# Altium schematic sheet S7CAS-PLEIADES-CARTE-FILLE_P02_DAC.SchDoc
size Tabloid; DocumentNumber: 5; SheetNumber: 5; SheetTotal: 5; Size: 11x17; Sheet_Name: DAC
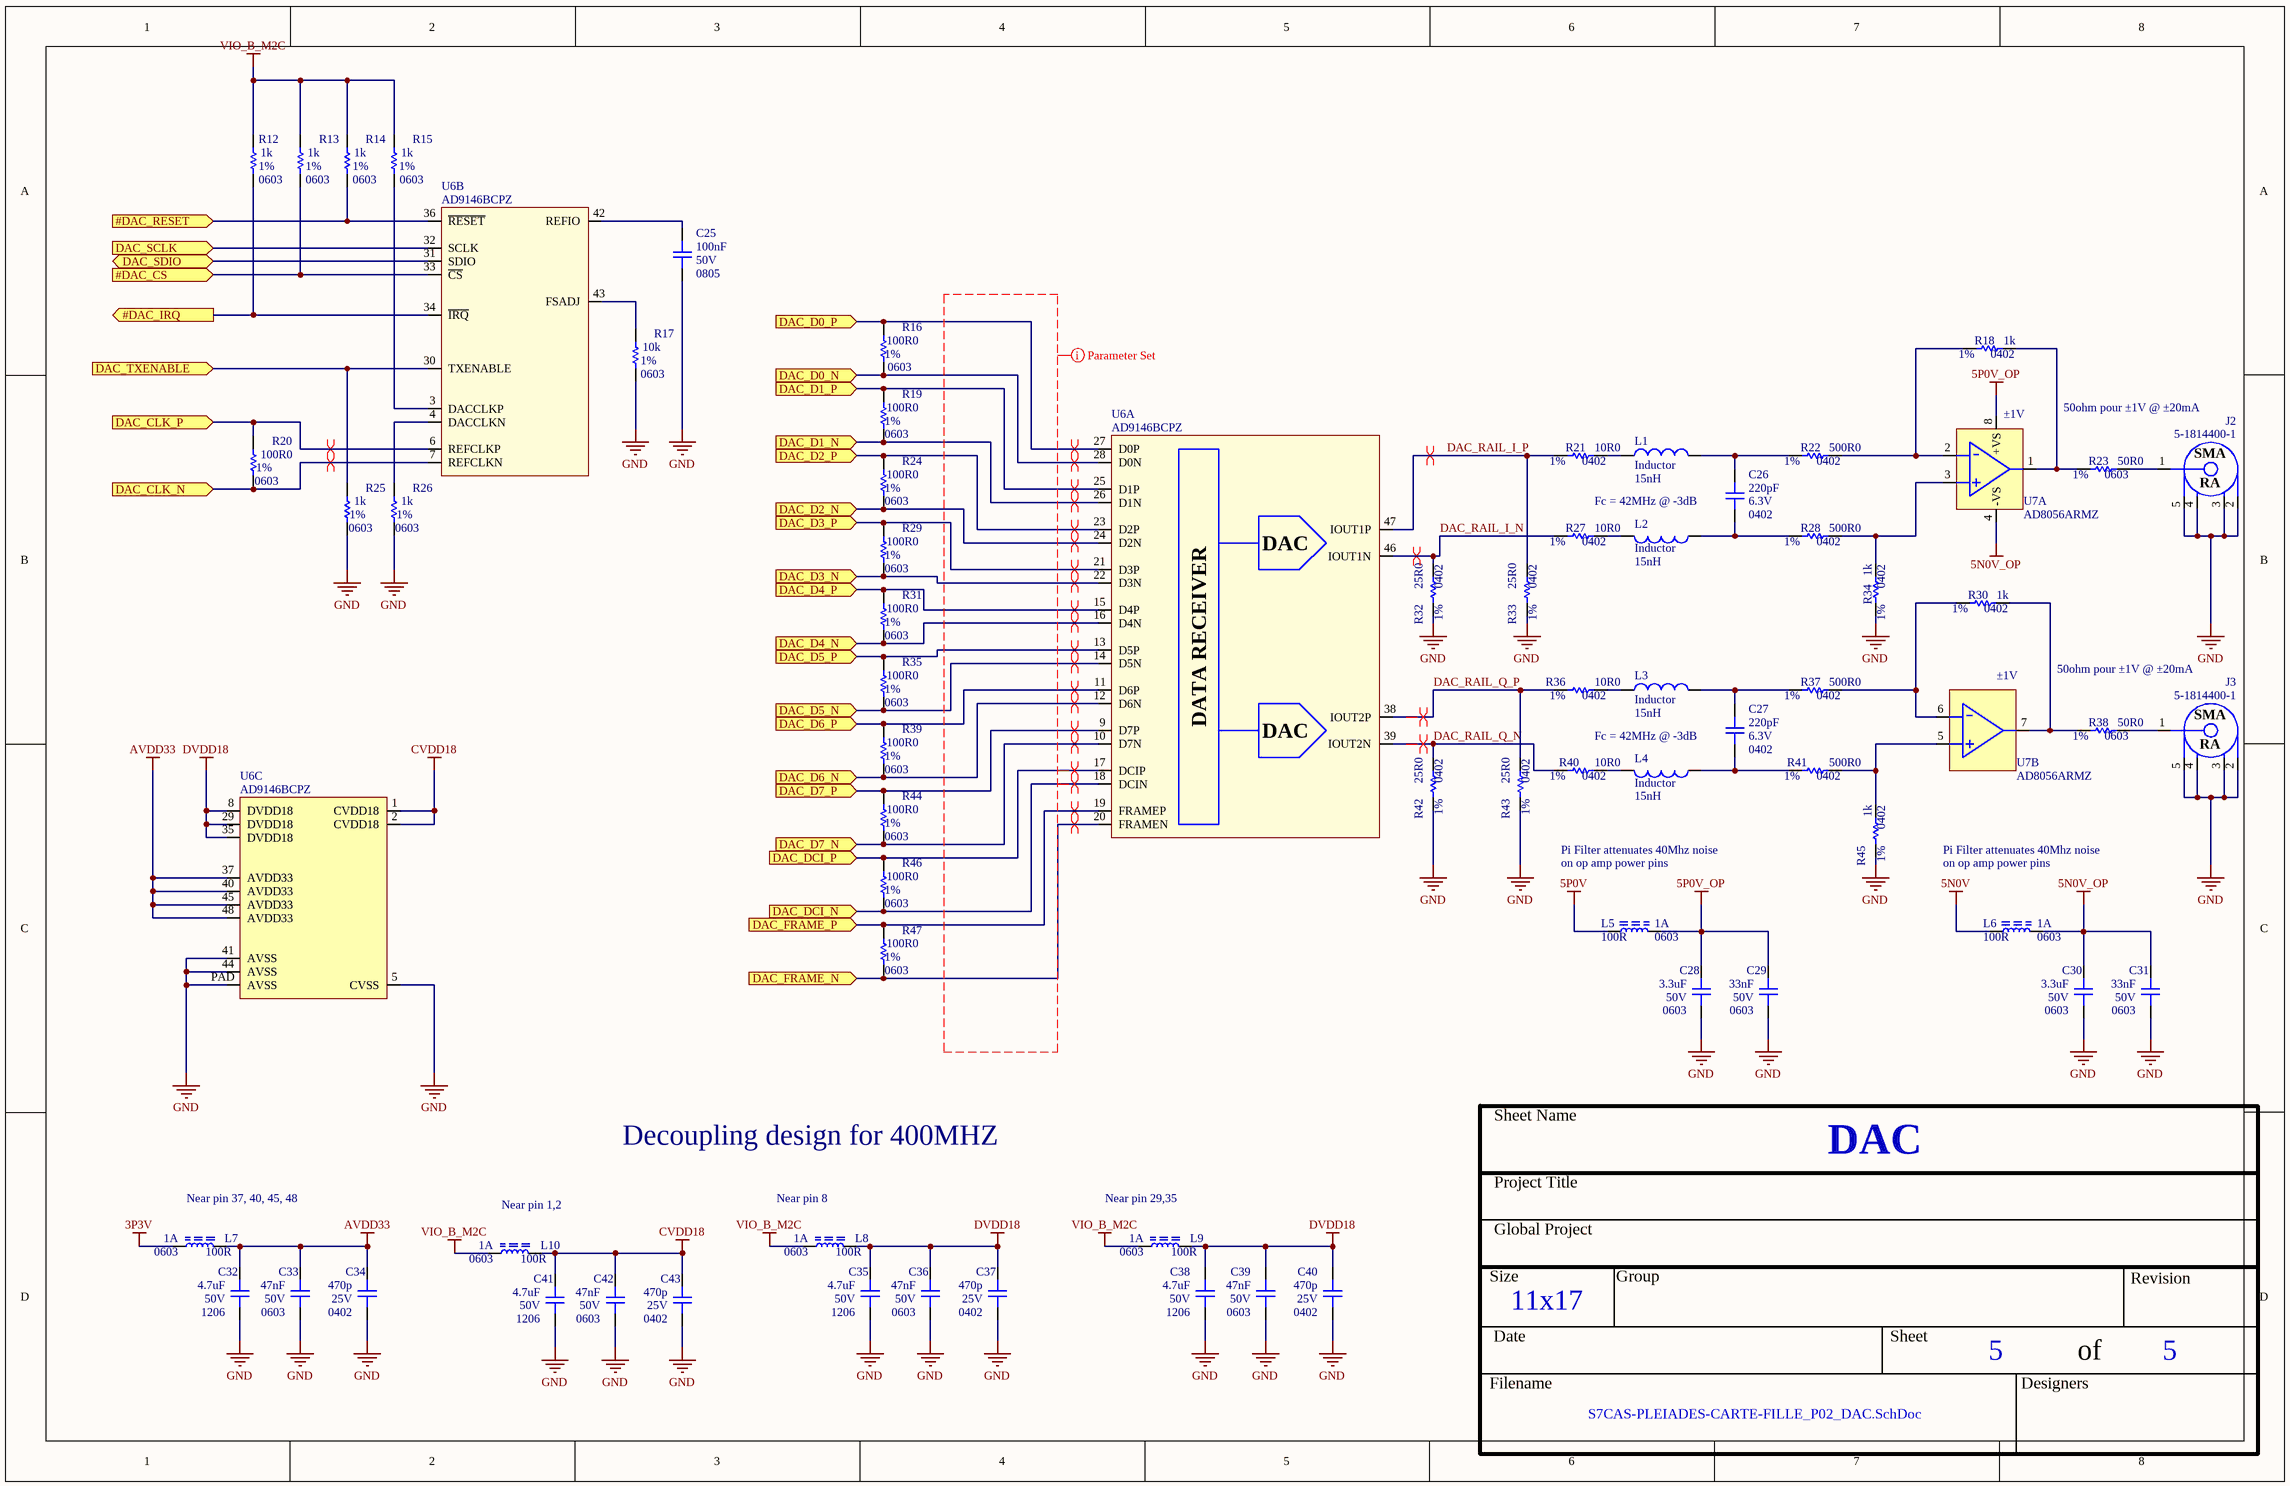
[diagram p0: S7CAS-PLEIADES-CARTE-FILLE_P02_DAC.SchDoc]

## Parts
C25  value 100nF  Voltage: 50V  Package: 0805  [CAP_0805]  (hidden comment: CAP - 0805)
C26  value 220pF  Voltage: 6.3V  Package: 0402  [CAP_0402]  (hidden comment: CAP - 0402)
C27  value 220pF  Voltage: 6.3V  Package: 0402  [CAP_0402]  (hidden comment: CAP - 0402)
C28  value 3.3uF  Voltage: 50V  Package: 0603  [CAP_0603]  (hidden comment: CAP - 0603)
C29  value 33nF  Voltage: 50V  Package: 0603  [CAP_0603]  (hidden comment: CAP - 0603)
C30  value 3.3uF  Voltage: 50V  Package: 0603  [CAP_0603]  (hidden comment: CAP - 0603)
C31  value 33nF  Voltage: 50V  Package: 0603  [CAP_0603]  (hidden comment: CAP - 0603)
C32  value 4.7uF  Voltage: 50V  Package: 1206  [CAP_1206]  (hidden comment: CAP - 1206)
C33  value 47nF  Voltage: 50V  Package: 0603  [CAP_0603]  (hidden comment: CAP - 0603)
C34  value 470p  Voltage: 25V  Package: 0402  [CAP_0402]  (hidden comment: CAP - 0402)
C35  value 4.7uF  Voltage: 50V  Package: 1206  [CAP_1206]  (hidden comment: CAP - 1206)
C36  value 47nF  Voltage: 50V  Package: 0603  [CAP_0603]  (hidden comment: CAP - 0603)
C37  value 470p  Voltage: 25V  Package: 0402  [CAP_0402]  (hidden comment: CAP - 0402)
C38  value 4.7uF  Voltage: 50V  Package: 1206  [CAP_1206]  (hidden comment: CAP - 1206)
C39  value 47nF  Voltage: 50V  Package: 0603  [CAP_0603]  (hidden comment: CAP - 0603)
C40  value 470p  Voltage: 25V  Package: 0402  [CAP_0402]  (hidden comment: CAP - 0402)
C41  value 4.7uF  Voltage: 50V  Package: 1206  [CAP_1206]  (hidden comment: CAP - 1206)
C42  value 47nF  Voltage: 50V  Package: 0603  [CAP_0603]  (hidden comment: CAP - 0603)
C43  value 470p  Voltage: 25V  Package: 0402  [CAP_0402]  (hidden comment: CAP - 0402)
J2  5-1814400-1  [CONN_SMA_5-1814400-1]
J3  5-1814400-1  [CONN_SMA_5-1814400-1]
L1  Inductor  value 15nH  [0603]
L2  Inductor  value 15nH  [0603]
L3  Inductor  value 15nH  [0603]
L4  Inductor  value 15nH  [0603]
L5  value 100R  Current: 1A  Package: 0603  [FER_0603]  (hidden comment: FER - 0603)
L6  value 100R  Current: 1A  Package: 0603  [FER_0603]  (hidden comment: FER - 0603)
L7  value 100R  Current: 1A  Package: 0603  [FER_0603]  (hidden comment: FER - 0603)
L8  value 100R  Current: 1A  Package: 0603  [FER_0603]  (hidden comment: FER - 0603)
L9  value 100R  Current: 1A  Package: 0603  [FER_0603]  (hidden comment: FER - 0603)
L10  value 100R  Current: 1A  Package: 0603  [FER_0603]  (hidden comment: FER - 0603)
R12  value 1k  Package: 0603  Precision: 1%  [RES_0603]  (hidden comment: RES - 0603)
R13  value 1k  Package: 0603  Precision: 1%  [RES_0603]  (hidden comment: RES - 0603)
R14  value 1k  Package: 0603  Precision: 1%  [RES_0603]  (hidden comment: RES - 0603)
R15  value 1k  Package: 0603  Precision: 1%  [RES_0603]  (hidden comment: RES - 0603)
R16  value 100R0  Package: 0603  Precision: 1%  [RES_0603]  (hidden comment: RES - 0603)
R17  value 10k  Package: 0603  Precision: 1%  [RES_0603]  (hidden comment: RES - 0603)
R18  value 1k  Package: 0402  Precision: 1%  [RES_0402]  (hidden comment: RES - 0402)
R19  value 100R0  Package: 0603  Precision: 1%  [RES_0603]  (hidden comment: RES - 0603)
R20  value 100R0  Package: 0603  Precision: 1%  [RES_0603]  (hidden comment: RES - 0603)
R21  value 10R0  Package: 0402  Precision: 1%  [RES_0402]  (hidden comment: RES - 0402)
R22  value 500R0  Package: 0402  Precision: 1%  [RES_0402]  (hidden comment: RES - 0402)
R23  value 50R0  Package: 0603  Precision: 1%  [RES_0402]  (hidden comment: RES - 0402)
R24  value 100R0  Package: 0603  Precision: 1%  [RES_0603]  (hidden comment: RES - 0603)
R25  value 1k  Package: 0603  Precision: 1%  [RES_0603]  (hidden comment: RES - 0603)
R26  value 1k  Package: 0603  Precision: 1%  [RES_0603]  (hidden comment: RES - 0603)
R27  value 10R0  Package: 0402  Precision: 1%  [RES_0402]  (hidden comment: RES - 0402)
R28  value 500R0  Package: 0402  Precision: 1%  [RES_0402]  (hidden comment: RES - 0402)
R29  value 100R0  Package: 0603  Precision: 1%  [RES_0603]  (hidden comment: RES - 0603)
R30  value 1k  Package: 0402  Precision: 1%  [RES_0402]  (hidden comment: RES - 0402)
R31  value 100R0  Package: 0603  Precision: 1%  [RES_0603]  (hidden comment: RES - 0603)
R32  value 25R0  Package: 0402  Precision: 1%  [RES_0402]  (hidden comment: RES - 0402)
R33  value 25R0  Package: 0402  Precision: 1%  [RES_0402]  (hidden comment: RES - 0402)
R34  value 1k  Package: 0402  Precision: 1%  [RES_0402]  (hidden comment: RES - 0402)
R35  value 100R0  Package: 0603  Precision: 1%  [RES_0603]  (hidden comment: RES - 0603)
R36  value 10R0  Package: 0402  Precision: 1%  [RES_0402]  (hidden comment: RES - 0402)
R37  value 500R0  Package: 0402  Precision: 1%  [RES_0402]  (hidden comment: RES - 0402)
R38  value 50R0  Package: 0603  Precision: 1%  [RES_0402]  (hidden comment: RES - 0402)
R39  value 100R0  Package: 0603  Precision: 1%  [RES_0603]  (hidden comment: RES - 0603)
R40  value 10R0  Package: 0402  Precision: 1%  [RES_0402]  (hidden comment: RES - 0402)
R41  value 500R0  Package: 0402  Precision: 1%  [RES_0402]  (hidden comment: RES - 0402)
R42  value 25R0  Package: 0402  Precision: 1%  [RES_0402]  (hidden comment: RES - 0402)
R43  value 25R0  Package: 0402  Precision: 1%  [RES_0402]  (hidden comment: RES - 0402)
R44  value 100R0  Package: 0603  Precision: 1%  [RES_0603]  (hidden comment: RES - 0603)
R45  value 1k  Package: 0402  Precision: 1%  [RES_0402]  (hidden comment: RES - 0402)
R46  value 100R0  Package: 0603  Precision: 1%  [RES_0603]  (hidden comment: RES - 0603)
R47  value 100R0  Package: 0603  Precision: 1%  [RES_0603]  (hidden comment: RES - 0603)
U6  AD9146BCPZ  [DAC_AD9146BCPZ]  (parts A,B,C of 3)
U7  AD8056ARMZ  [OPAMP_AD8056ARMZ]  (parts A,B of 2)

## Ports
#DAC_CS (in), #DAC_IRQ (out), #DAC_RESET (in), DAC_CLK_N (in), DAC_CLK_P (in), DAC_D0_N (in), DAC_D0_P (in), DAC_D1_N (in), DAC_D1_P (in), DAC_D2_N (in), DAC_D2_P (in), DAC_D3_N (in), DAC_D3_P (in), DAC_D4_N (in), DAC_D4_P (in), DAC_D5_N (in), DAC_D5_P (in), DAC_D6_N (in), DAC_D6_P (in), DAC_D7_N (in), DAC_D7_P (in), DAC_DCI_N (in), DAC_DCI_P (in), DAC_FRAME_N (in), DAC_FRAME_P (in), DAC_SCLK (in), DAC_SDIO (bidir), DAC_TXENABLE (in)

## Nets
3P3V: L7.1
5N0V: L6.2
5N0V_OP: C30.2 C31.2 L6.1 U7.4(-VS)
5P0V: L5.2
5P0V_OP: C28.2 C29.2 L5.1 U7.8(+VS)
AVDD33: C32.2 C33.2 C34.2 L7.2 U6.37(AVDD33) U6.40(AVDD33) U6.45(AVDD33) U6.48(AVDD33)
CVDD18: C41.2 C42.2 C43.2 L10.2 U6.1(CVDD18) U6.2(CVDD18)
DVDD18: C35.2 C36.2 C37.2 C38.2 C39.2 C40.2 L8.2 L9.2 U6.8(DVDD18) U6.29(DVDD18) U6.35(DVDD18)
GND: C25.1 C28.1 C29.1 C30.1 C31.1 C32.1 C33.1 C34.1 C35.1 C36.1 C37.1 C38.1 C39.1 C40.1 C41.1 C42.1 C43.1 J2.2 J2.3 J2.4 J2.5 J3.2 J3.3 J3.4 J3.5 R17.1 R25.1 R26.1 R32.2 R33.2 R34.2 R42.2 R43.2 R45.2 U6.5(CVSS) U6.41(AVSS) U6.44(AVSS) U6.PAD(AVSS)
VIO_B_M2C: L8.1 L9.1 L10.1 R12.2 R13.2 R14.2 R15.2
#DAC_CS: R13.1 U6.33(~{CS}) ; port #DAC_CS
#DAC_IRQ: R12.1 U6.34(~{IRQ}) ; port #DAC_IRQ
#DAC_RESET: R14.1 U6.36(~{RESET}) ; port #DAC_RESET
DAC_CLK_N: R20.1 U6.7(REFCLKN) ; port DAC_CLK_N
DAC_CLK_P: R20.2 U6.6(REFCLKP) ; port DAC_CLK_P
DAC_D0_N: R16.1 U6.28(D0N) ; port DAC_D0_N
DAC_D0_P: R16.2 U6.27(D0P) ; port DAC_D0_P
DAC_D1_N: R19.1 U6.26(D1N) ; port DAC_D1_N
DAC_D1_P: R19.2 U6.25(D1P) ; port DAC_D1_P
DAC_D2_N: R24.1 U6.24(D2N) ; port DAC_D2_N
DAC_D2_P: R24.2 U6.23(D2P) ; port DAC_D2_P
DAC_D3_N: R29.1 U6.22(D3N) ; port DAC_D3_N
DAC_D3_P: R29.2 U6.21(D3P) ; port DAC_D3_P
DAC_D4_N: R31.1 U6.16(D4N) ; port DAC_D4_N
DAC_D4_P: R31.2 U6.15(D4P) ; port DAC_D4_P
DAC_D5_N: R35.1 U6.14(D5N) ; port DAC_D5_N
DAC_D5_P: R35.2 U6.13(D5P) ; port DAC_D5_P
DAC_D6_N: R39.1 U6.12(D6N) ; port DAC_D6_N
DAC_D6_P: R39.2 U6.11(D6P) ; port DAC_D6_P
DAC_D7_N: R44.1 U6.10(D7N) ; port DAC_D7_N
DAC_D7_P: R44.2 U6.9(D7P) ; port DAC_D7_P
DAC_DCI_N: R46.1 U6.18(DCIN) ; port DAC_DCI_N
DAC_DCI_P: R46.2 U6.17(DCIP) ; port DAC_DCI_P
DAC_FRAME_N: R47.1 U6.20(FRAMEN) ; port DAC_FRAME_N
DAC_FRAME_P: R47.2 U6.19(FRAMEP) ; port DAC_FRAME_P
DAC_RAIL_I_N: R27.2 R32.1 U6.46(IOUT1N)
DAC_RAIL_I_P: R21.2 R33.1 U6.47(IOUT1P)
DAC_RAIL_Q_N: R40.2 R42.1 U6.39(IOUT2N)
DAC_RAIL_Q_P: R36.2 R43.1 U6.38(IOUT2P)
DAC_SCLK: U6.32(SCLK) ; port DAC_SCLK
DAC_SDIO: U6.31(SDIO) ; port DAC_SDIO
DAC_TXENABLE: R25.2 U6.30(TXENABLE) ; port DAC_TXENABLE
NetC25_2: C25.2 U6.42(REFIO)
NetC26_1: C26.1 L2.1 R28.2
NetC26_2: C26.2 L1.2 R22.2
NetC27_1: C27.1 L4.1 R41.2
NetC27_2: C27.2 L3.2 R37.2
NetJ2_1: J2.1 R23.1
NetJ3_1: J3.1 R38.1
NetL1_1: L1.1 R21.1
NetL2_2: L2.2 R27.1
NetL3_1: L3.1 R36.1
NetL4_2: L4.2 R40.1
NetR15_1: R15.1 U6.3(DACCLKP)
NetR17_2: R17.2 U6.43(FSADJ)
NetR18_1: R18.1 R23.2 U7.1(OUT1)
NetR18_2: R18.2 R22.1 U7.2(-IN1)
NetR26_2: R26.2 U6.4(DACCLKN)
NetR28_1: R28.1 R34.1 U7.3(+IN1)
NetR30_1: R30.1 R38.2 U7.7(OUT2)
NetR30_2: R30.2 R37.1 U7.6(-IN2)
NetR41_1: R41.1 R45.1 U7.5(+IN2)

## Layout directives
differential pair; differential pair class DAC_DIF: DAC_CLK_N, DAC_CLK_P, DAC_D0_N, DAC_D0_P, DAC_D1_N, DAC_D1_P, DAC_D2_N, DAC_D2_P, DAC_D3_N, DAC_D3_P, DAC_D4_N, DAC_D4_P, DAC_D5_N, DAC_D5_P, DAC_D6_N, DAC_D6_P, DAC_D7_N, DAC_D7_P, DAC_RAIL_I_N, DAC_RAIL_I_P, DAC_RAIL_Q_N, DAC_RAIL_Q_P
differential pair; differential pair class DAC_DIF; net class DIFF100: DAC_DCI_N, DAC_DCI_P, DAC_FRAME_N, DAC_FRAME_P
rule Differential Pairs Routing [Pref Gap = 10mil    Min Gap  = 10mil    Max Gap  = 10milPref Width = 15mil    Min Width  = 15mil    Max Width  = 15mil]: (no net found under the mark)

## Notes on the sheet
- (near U7) ±1V
- 50ohm pour ±1V @ ±20mA
- Fc = 42MHz @ -3dB
- Pi Filter attenuates 40Mhz noise
- on op amp power pins
- Decoupling design for 400MHZ
- (near L7) Near pin 37, 40, 45, 48
- (near L10) Near pin 1,2
- (near L8) Near pin 8
- (near L9) Near pin 29,35
- Sheet Name
- Project Title
- Global Project
- Size
- Group
- Revision
- Date
- Sheet
- of
- Filename
- Designers
- (in symbol CONN_SMA_5-1814400-1) SMA; RA
- (in symbol DAC_AD9146BCPZ, part A) DAC; DATA RECEIVER

## Library data of the parts
C25 = CAP - 0805: Precision: 10%; Current: *; CreatedBy: Jonathan Bouchard; Power: *
C26 C27 = CAP - 0402: Mfg Part Number: GRM022R60J104KE15; Mfg: Murata; Precision: 10%; Current: *; CreatedBy: Jonathan Bouchard; Power: *
C28-C31 C33 C36 C39 C42 = CAP - 0603: Precision: 10%; Current: *; CreatedBy: Jonathan Bouchard; Power: *
C32 C35 C38 C41 = CAP - 1206: Precision: 10%; Current: *; CreatedBy: Jonathan Bouchard; Power: *
C34 C37 C40 C43 = CAP - 0402: Precision: 10%; Current: *; CreatedBy: Jonathan Bouchard; Power: *
J2 J3 = CONN_SMA_5-1814400-1: CONN -  SMA JACK R/A 50 OHM - TH; Mfg: TE Connectivity AMP Connectors; Voltage: *; Current: *; Power: *; Mfg Part Number: 5-1814400-1; HelpURL: http://www.te.com/commerce/DocumentDelivery/DDEController?Action=srchrtrv&DocNm=1814400&DocType=Customer+Drawing&DocLang=English; CreatedBy: Jonathan Bouchard; Temperature: -55°C ~ 85°C; Value: *; Precision: *; Package: TH-5; Supplier 1: Digikey; Supplier Part Number 1: A97593-ND
L1-L4 = Inductor: Code_IEC: 1005; Published: 8-Jun-2000; LatestRevisionDate: 29-May-2009; LatestRevisionNote: IPC-7351 Footprint Added.; PackageReference: 0402-A; Publisher: Altium Limited; PackageDescription: Chip Inductor; Code_JEITA: 0402
R18 R21-R23 R27 R28 R30 R32-R34 R36-R38 R40-R43 R45 = RES - 0402: Voltage: 50V; Power: 1/16W; Current: *; CreatedBy: Jonathan Bouchard
U6 = DAC_AD9146BCPZ: DAC - 16BIT SRL HIGH SPEED - QFN-48; Voltage: 3.13 V ~ 3.47 V / 1.71 V ~ 1.89 V; Mfg: Analog Devices Inc.; Current: *; Power: *; Mfg Part Number: AD9146BCPZ; HelpURL: http://www.analog.com/media/en/technical-documentation/data-sheets/AD9146.PDF; CreatedBy: Jonathan Bouchard; Temperature: -40°C ~ 85°C; Value: *; Precision: 16 Bit; Package: QFN-48; Supplier 1: Digikey; Supplier Part Number 1: AD9146BCPZ-ND
U7 = OPAMP_AD8056ARMZ: OPAMP - VFB 300MHZ - 8MSOP; Voltage: 8 V ~ 12 V, ±4 V ~ 6 V; Current: 60mA; Mfg: Analog Devices; Power: *; Mfg Part Number: AD8056ARMZ; HelpURL: http://www.analog.com/media/en/technical-documentation/data-sheets/AD8055_8056.pdf; CreatedBy: Jonathan Bouchard; Temperature: -40°C ~ 125°C; Value: *; Precision: *; Package: MSOP-8; Supplier 1: Digikey; Supplier Part Number 1: AD8056ARMZ-REEL7CT-ND
L5-L10 = FER - 0603: Voltage: *; CreatedBy: Jonathan Bouchard; Power: *; Precision: *
R12-R17 R19 R20 R24-R26 R29 R31 R35 R39 R44 R46 R47 = RES - 0603: Current: *; CreatedBy: Jonathan Bouchard